# EasyEDA Pro project 3轴6.1--esp32 -(8-15) - 导BOM.eprj, board PCB
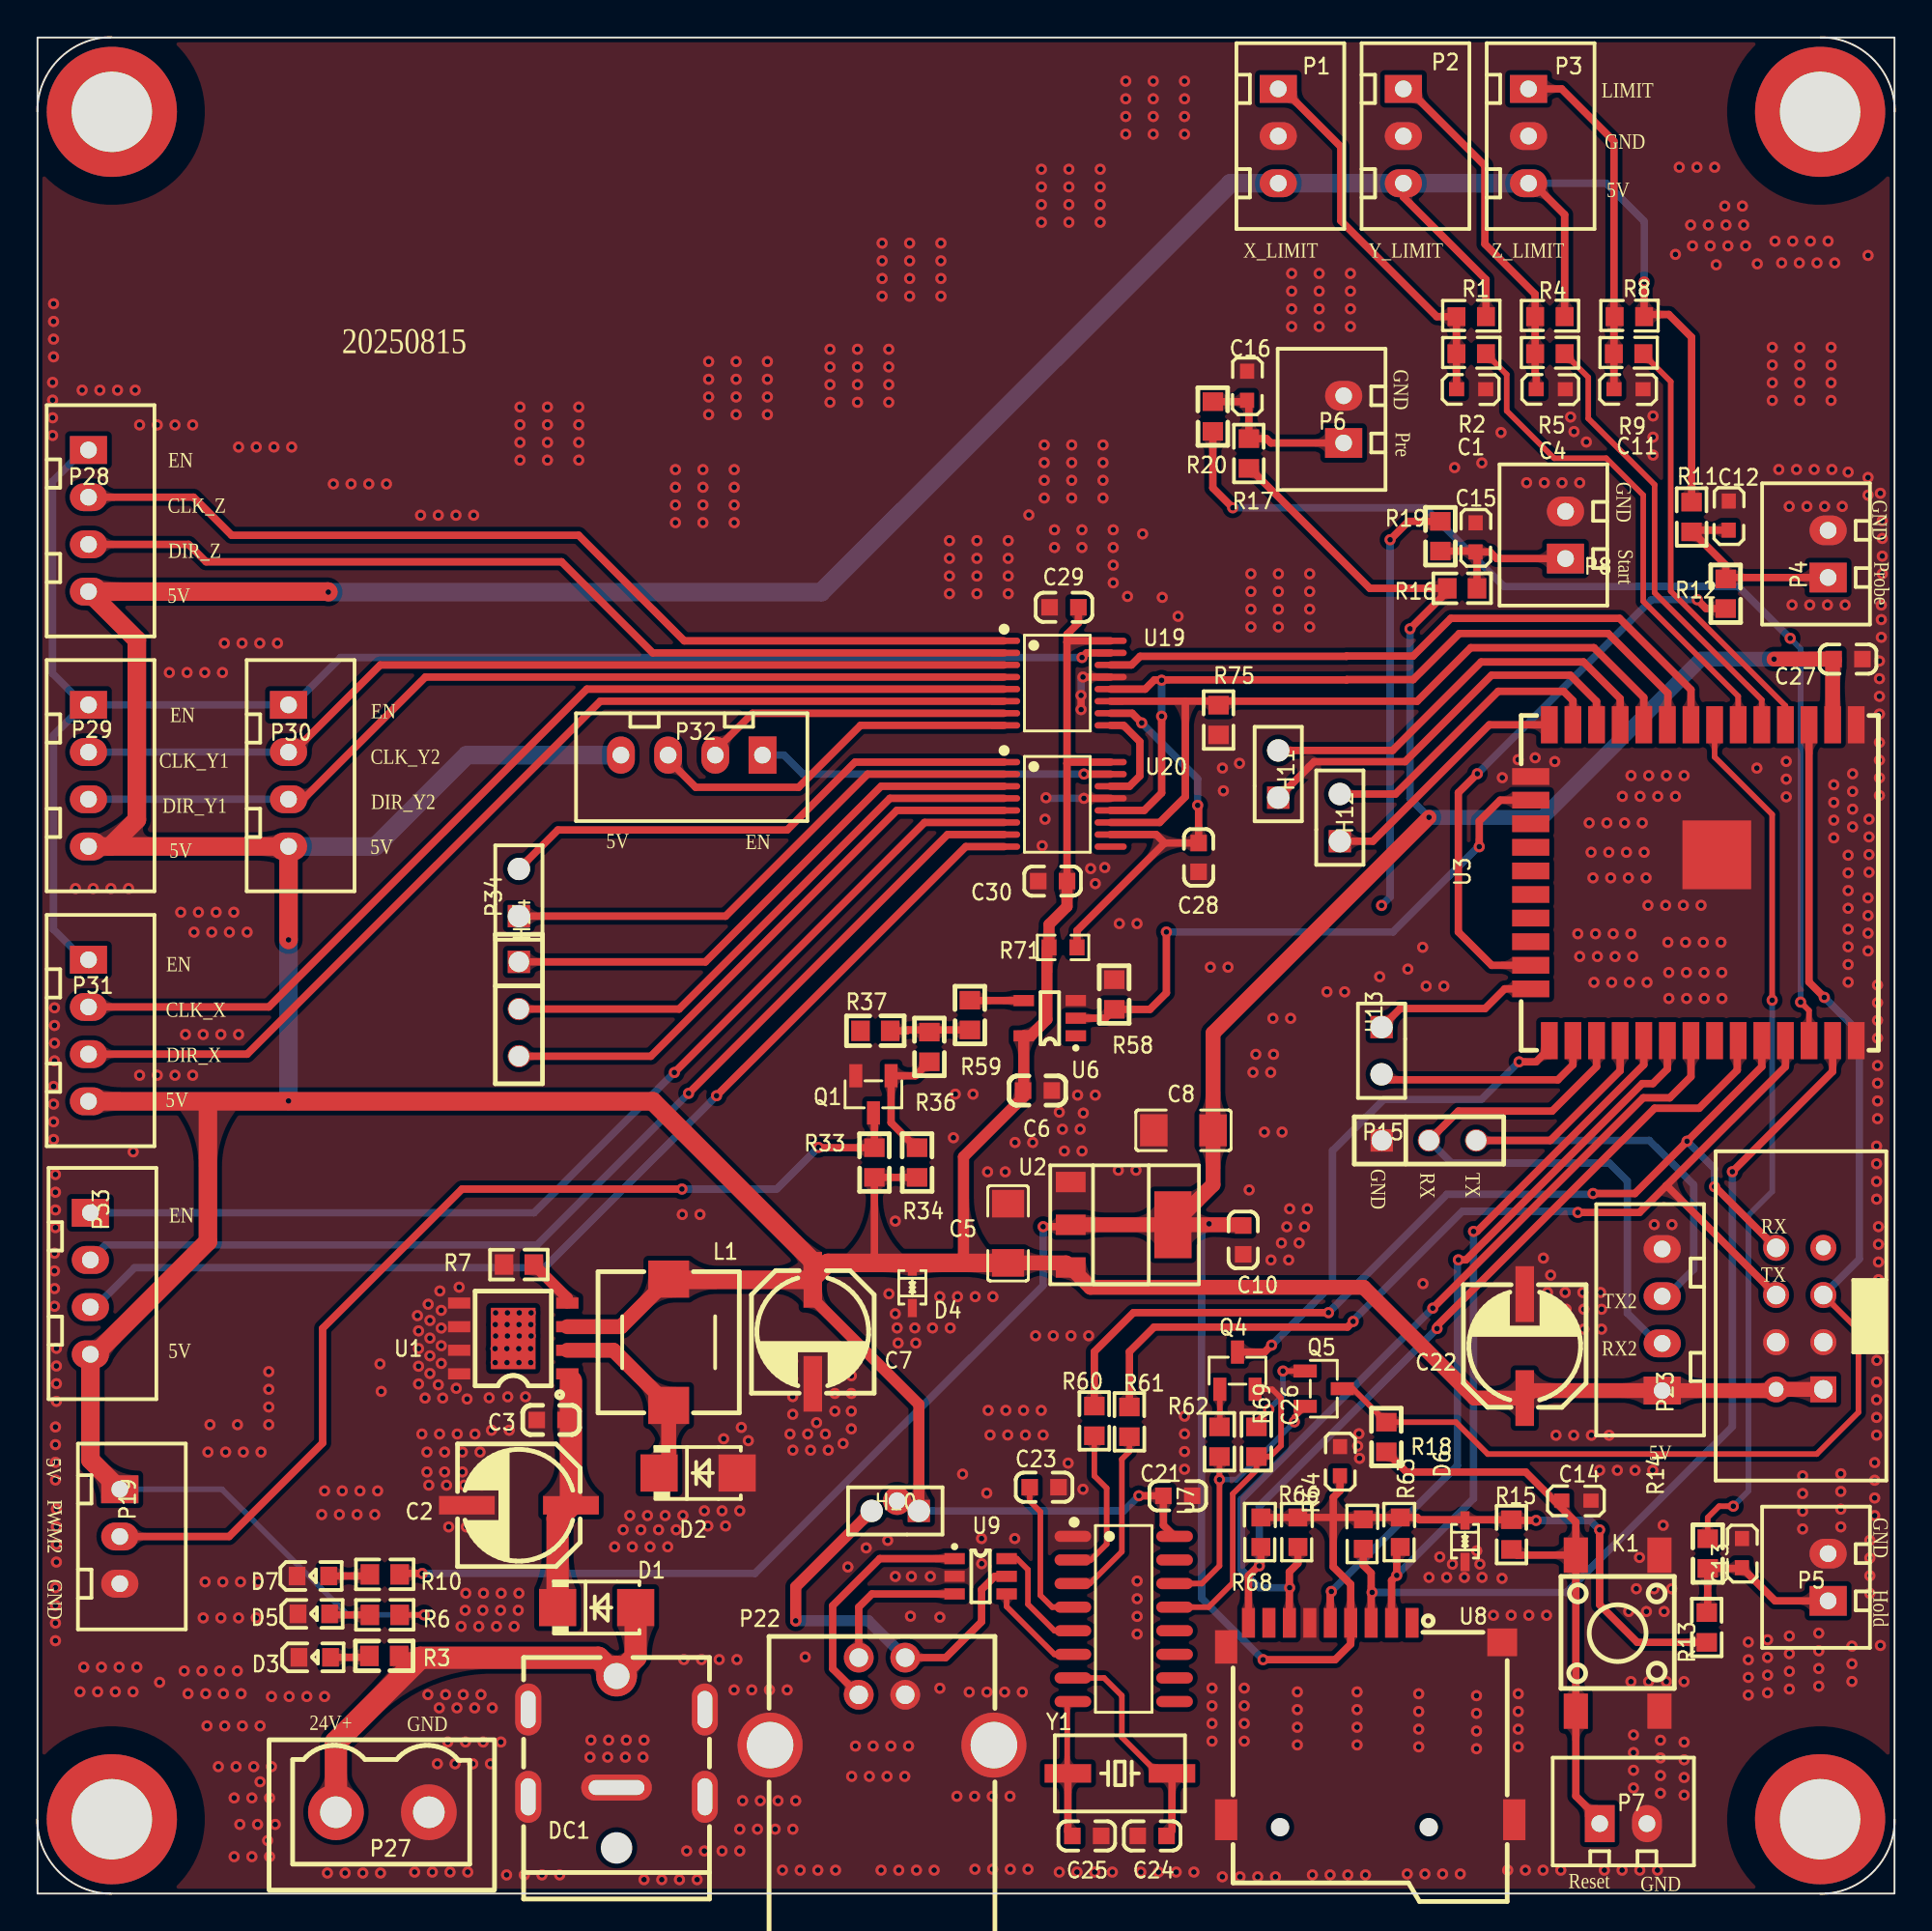
[diagram p1: board, top side]
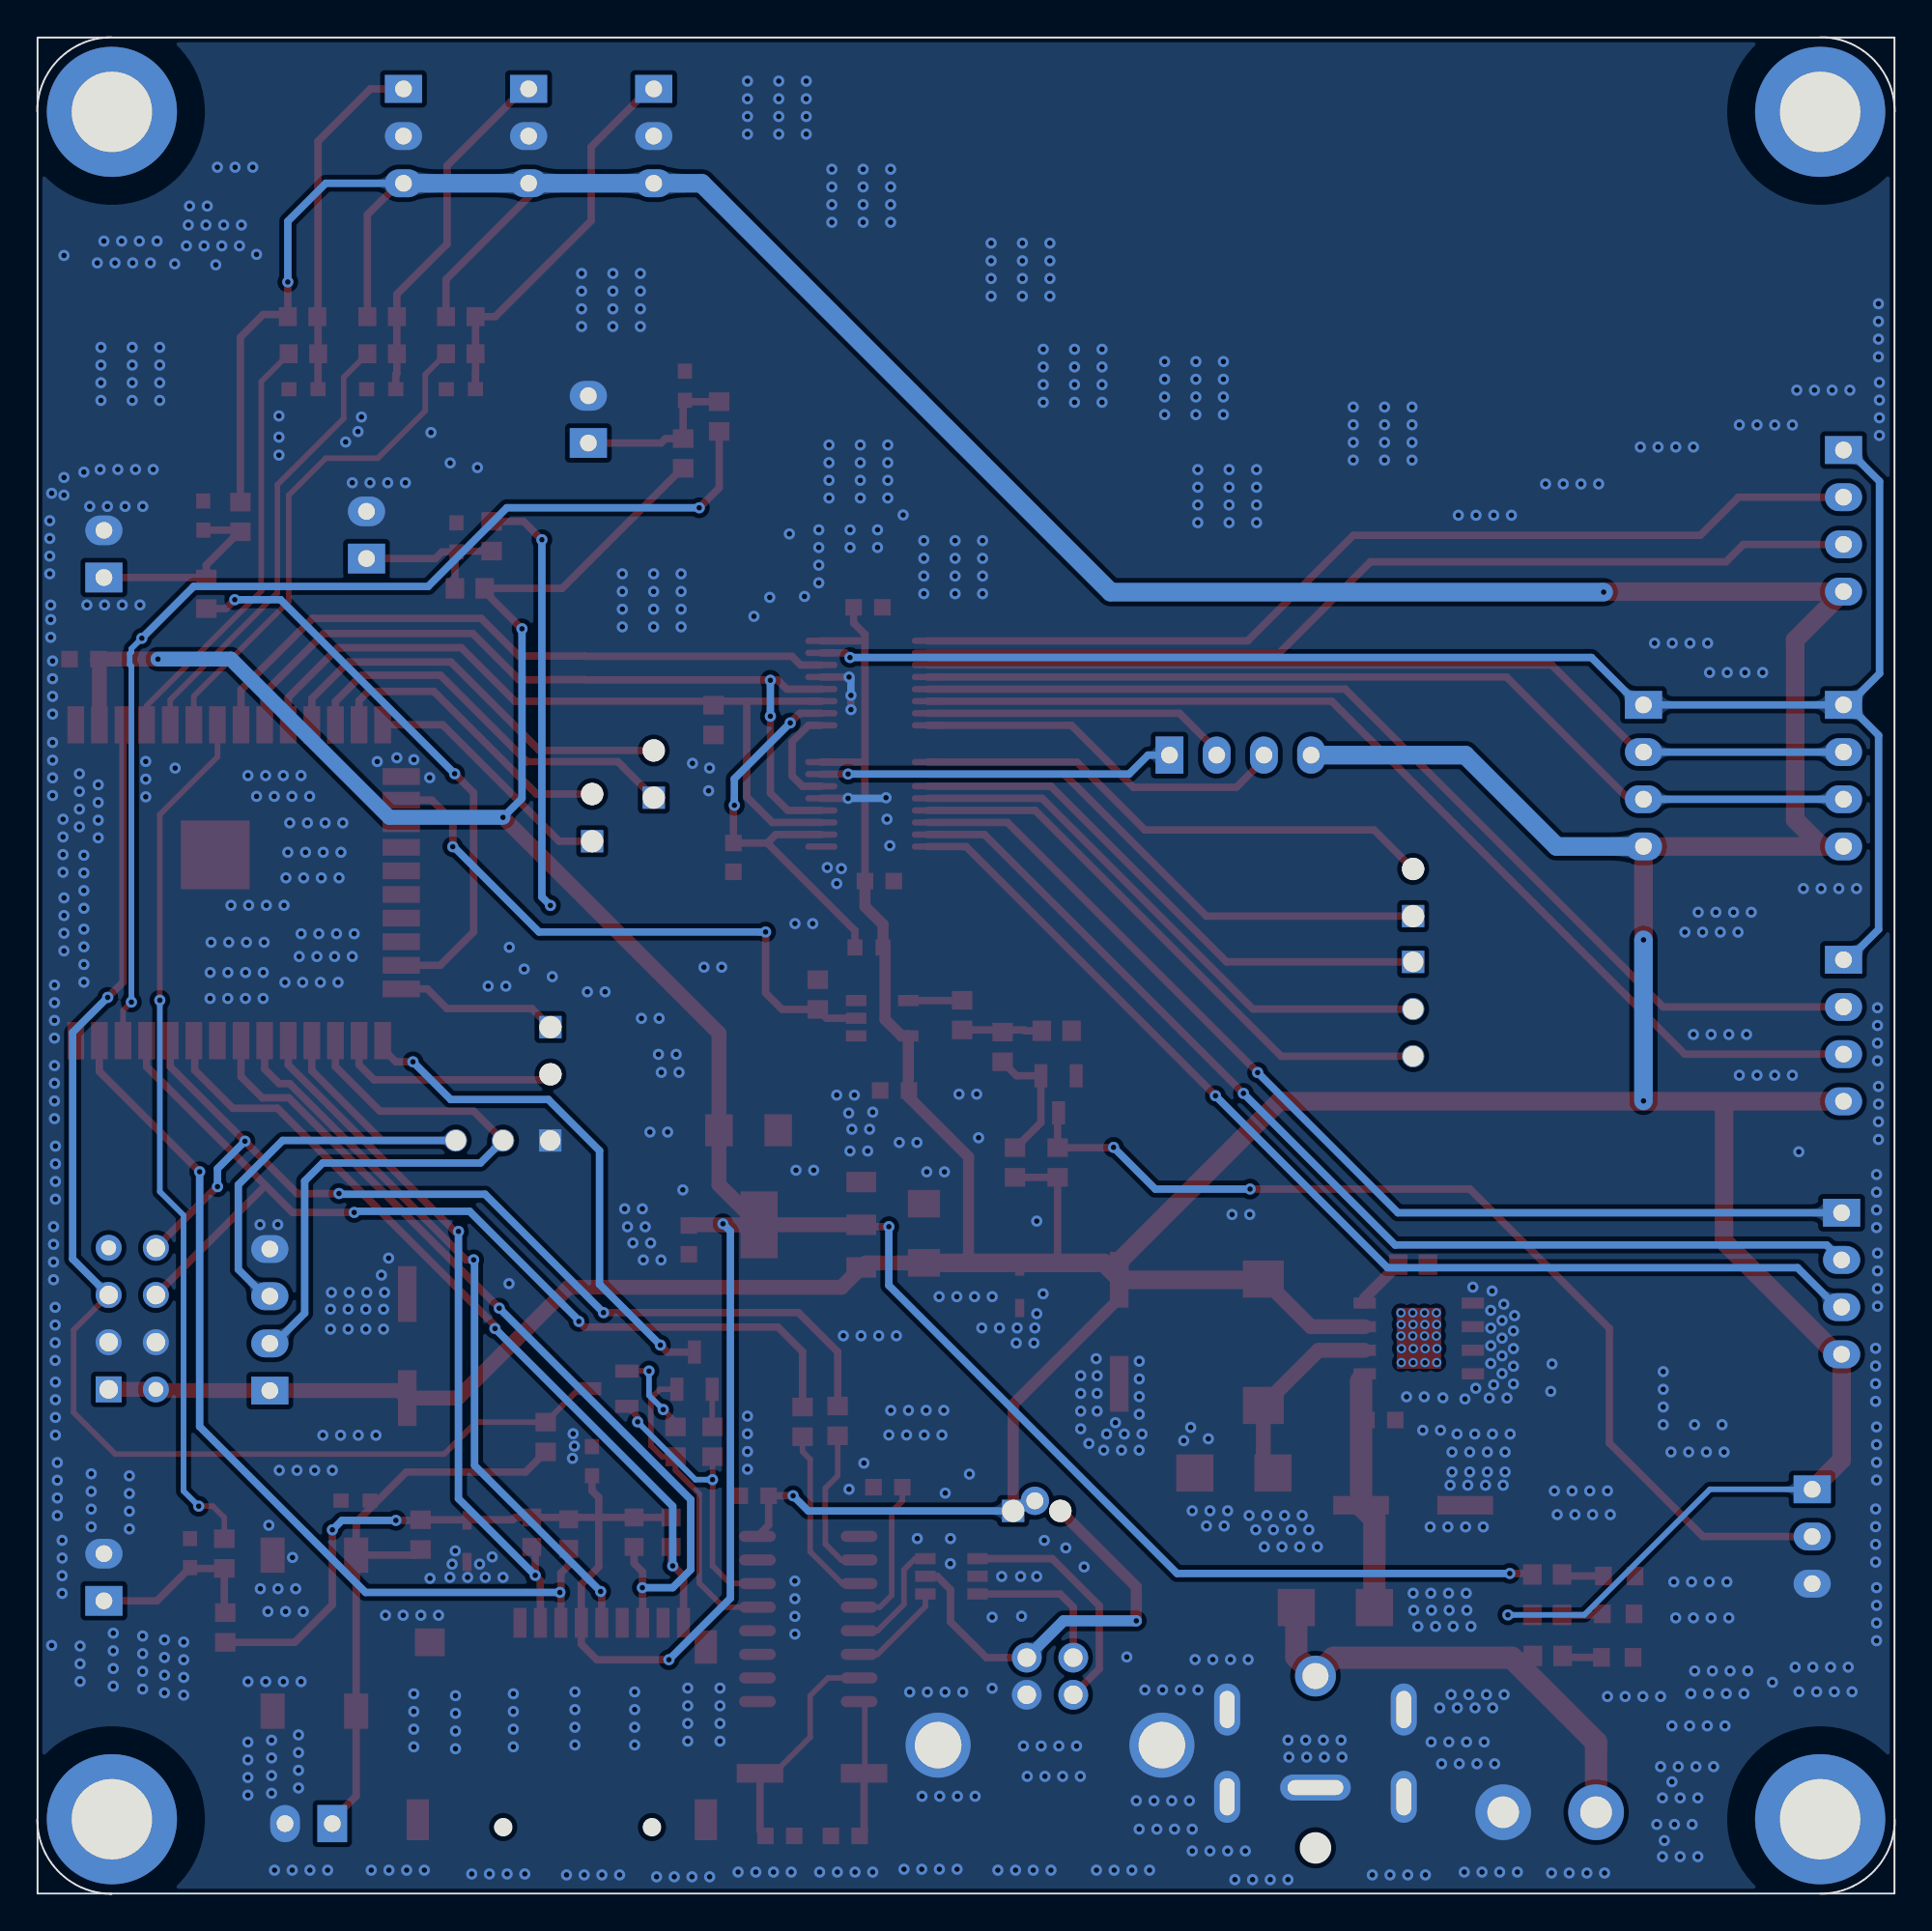
[diagram p2: board, bottom side, seen from below]

Outline 99.94 x 99.94 mm; copper layers: Top Layer, Bottom Layer. Coordinates in mm from the lower left corner of the outline.
Outline path: rectangle 0.02,99.92 99.92,0.02 ; 0.01,95.94 arc(1.18,98.77) 4.01,99.94 ; 4,0.01 arc(1.17,1.18) 0,4.01 ; 95.94,99.93 arc(98.77,98.76) 99.94,95.93 ; 99.93,4 arc(98.76,1.17) 95.93,0
Stack: Top Layer 0.035mm / Dielectric1 1.51mm FR4 er 4.5 / Bottom Layer 0.035mm

## Design rules (mm)
template: 用户自定义配置
spacing Default (default): track to track 0.152, other pairs 0 to 0.152
track width Default (default): min 0.254, default 0.254, max 25.4
differential pair differentialPair (default): width min 0.127, default 0.254, max 2.54; gap min 0.152, default 0.152
via Default (default): diameter min 0.25, default 0.61, max 100.025; hole min 0.2, default 0.305, max 59.995

## Placement (name value [footprint] x y rotation side)
C1  103  [11]  77.88 80.69 0 top
C2  100uF/35V  [电解电容贴片6X6]  25.91 20.92 180 top
C3  104  [0603C]  27.65 25.51 0 top
C4  103  [11]  82.17 80.69 0 top
C5  10uF  [C1206]  52.23 35.55 90 top
C6  104  [0603C]  53.81 43.24 180 top
C7  100uF/35V  [电解电容贴片6X6]  41.72 30.25 270 top
C8  4.7uF  [C1206]  61.67 41.1 0 top
C10  104  [0603C]  64.88 35.2 90 top
C11  103  [11]  86.35 80.69 0 top
C12  103  [11]  91.3 74.93 90 top
C13  103  [11]  92.01 19.08 90 top
C14  103  [11]  83.55 20.87 0 top
C15  103  [11]  77.68 73.75 90 top
C16  103  [11]  65.39 81.91 90 top
C21  104  [0603C]  61.36 21.43 0 top
C22  100uF/35V  [电解电容贴片6X6]  80.03 29.48 90 top
C23  104  [0603C]  54.17 21.89 0 top
C24  18pF  [0603C]  59.98 3.12 180 top
C25  18pF  [0603C]  56.46 3.12 0 top
C26  104  [11]  70.39 24.03 90 top
C27  104  [0603C]  97.42 66.46 0 top
C28  104  [0603C]  62.48 55.79 90 top
C29  104  [0603C]  55.24 69.25 180 top
C30  104  [0603C]  54.63 54.51 180 top
D1  SS56  [SMA]  30.1 15.41 0 top
D2  SS34  [SMA]  35.55 22.65 0 top
D3  绿光  [0603LED]  14.9 12.71 180 top
D4  PESD5V0L1BA-N  [SOD-323_L1.8-W1.3-LS2.5-BI]  47.08 32.65 90 top
D5  绿光  [0603LED]  14.85 15.05 180 top
D6  PESD3V3L1BA-N  [SOD-323_L1.8-W1.3-LS2.5-BI]  76.81 18.98 90 top
D7  绿光  [0603LED]  14.8 17.09 180 top
DC1  DC007B-2.5  [DC-IN-TH_HX-DC007B-2.5]  31.17 8.47 90 top
H10  PZ254V-11-02P  [HDR-TH_2P-P2.54-V-M]  46.16 20.61 180 top
H11  PZ254V-11-02P  [HDR-TH_2P-P2.54-V-M]  66.77 60.27 90 top
H12  PZ254V-11-02P  [HDR-TH_2P-P2.54-V-M]  70.08 57.93 90 top
H13  PZ254V-11-02P  [HDR-TH_2P-P2.54-V-M]  72.32 45.38 270 top
H14  PZ254V-11-02P  [HDR-TH_2P-P2.54-V-M]  25.91 53.89 90 top
K1  SW_6X6_H=12.0MM  [KEY-SMD_4P-L6.0-W6.0-P4.50-LS9.0]  85.03 14.03 270 top
L1  68uH  [IND-SMD_L7.0-W7.0_SMDRI74-330MT]  33.97 29.69 270 top
NOREF  -  [Pad_ie52]  95.92 4.02 90 top
NOREF#2  -  [Pad_ie51]  4.02 4.02 90 top
NOREF#3  -  [Pad_e1409]  46.26 21.16 0 top
NOREF#4  -  [Pad_ie53]  95.92 95.92 90 top
NOREF#5  -  [Pad_ie50]  4.02 95.92 90 top
P1  3P  [HDR1X3_CON]  66.77 94.61 270 top
P2  3P  [HDR1X3_CON]  73.5 94.61 270 top
P3  3P  [HDR1X3_CON]  80.23 94.61 270 top
P4  2P  [HDR1X2_CON]  96.35 72.12 90 top
P5  2P  [HDR1X2_CON]  96.35 17.04 90 top
P6  2P  [HDR1X2_CON]  70.29 79.36 90 top
P7  2P  [HDR1X2_CON]  85.33 3.78 0 top
P8  2P  [HDR1X2_CON]  82.22 73.14 90 top
P15  PZ254V-11-03P  [HDR-TH_3P-P2.54-V-M]  74.88 40.55 0 top
P19  3P  [HDR1X3_CON]  4.44 19.23 270 top
P21  8P  [IDC8]  95.07 30.96 90 top
P22  USB-B10-BRW  [USB-B-TH_USB-B10-BRW]  45.45 10.36 0 top
P23  4P  [HDR1X4_CON]  87.42 27.09 90 top
P27  5.08-2P  [CONN-TH_WJ2EDGVC-5.08-2P]  18.57 4.39 180 top
P28  4P  [HDR1X4_CON]  2.76 77.72 270 top
P29  4P  [HDR1X4_CON]  2.76 64 270 top
P30  4P  [HDR1X4_CON]  13.52 64 270 top
P31  4P  [HDR1X4_CON]  2.76 50.28 270 top
P32  4P  [HDR1X4_CON]  39.02 61.29 180 top
P33  4P  [HDR1X4_CON]  2.86 36.66 270 top
P34  PZ254V-11-03P  [HDR-TH_3P-P2.54-V-M]  25.91 47.62 270 top
Q1  SS8050  [SOT-23-3_L2.9-W1.3-P1.90-LS2.4-BR]  44.99 43.03 90 top
Q4  SS8050  [SOT-23-3_L2.9-W1.3-P1.90-LS2.4-BR]  64.57 28.16 270 top
Q5  SS8050  [SOT-23-3_L2.9-W1.3-P1.90-LS2.4-BR]  69.21 27.19 180 top
R1  20K  [10]  76.25 84.78 0 top
R2  100  [10]  76.25 82.78 0 top
R3  47K  [0603R]  18.67 12.81 0 top
R4  20K  [10]  80.49 84.78 0 top
R5  100  [10]  80.49 82.78 0 top
R6  10K  [0603R]  18.7 15.01 0 top
R7  10K  [0603R]  25.91 33.87 180 top
R8  20K  [10]  84.76 84.78 0 top
R9  100  [10]  84.72 82.78 0 top
R10  10K  [0603R]  18.7 17.19 0 top
R11  10K  [0603R]  89 74.11 270 top
R12  100  [0603R]  90.84 69.98 90 top
R13  10K  [0603R]  89.82 14.34 90 top
R14  100  [0603R]  89.87 18.32 270 top
R15  10K  [0603R]  79.31 19.34 270 top
R16  10K  [0603R]  76.66 70.27 0 top
R17  10K  [0603R]  65.19 77.53 90 top
R18  100  [0603R]  72.58 24.59 270 top
R19  100  [0603R]  75.49 73.07 270 top
R20  100  [0603R]  63.25 79.52 90 top
R33  10K  [0603R]  45.04 39.36 270 top
R34  10K  [0603R]  47.33 39.36 270 top
R36  1K  [0603R]  48 45.58 270 top
R37  0Ω  [0603R]  45.09 46.45 0 top
R58  10K  [0603R]  57.94 48.41 90 top
R59  100  [0603R]  50.18 47.3 270 top
R60  510Ω  [0603R]  56.87 25.46 90 top
R61  510Ω  [0603R]  58.76 25.41 90 top
R62  10K  [0603R]  63.6 24.33 90 top
R63  10K  [10]  73.45 18.57 90 top
R64  10K  [10]  71.46 18.47 90 top
R66  10K  [10]  67.94 18.57 90 top
R68  10K  [10]  65.95 18.57 90 top
R69  10K  [0603R]  65.59 24.33 90 top
R71  10kΩ  [R0603]  55.19 50.94 180 top
R75  10K  [0603R]  63.55 63.18 270 top
U1  XL1509-5.0E1//SXL1509-5.0E1  [ESOP-8_L4.9-W3.9-P1.27-LS6.0-BL-EP]  25.61 29.89 90 top
U2  1117-3.3  [SOT-223]  58.3 36.01 270 top
U3  ESP32-WROOM-32  [WIFI-SMD_ESP32-WROOM-32UE-A]  89.1 54.42 270 top
U6  74LVC1G17  [SOT-23-5]  54.48 47.13 180 top
U7  CH340G  [SOIC-16_L9.9-W3.9-P1.27-LS6.0-BL]  58.45 14.8 270 top
U8  自弹TF卡座TFAA  [SIM-SMD_C9900015645]  71.71 9.29 0 top
U9  USBLC2-2SC6  [SOT-23-6]  50.75 17.09 0 top
U19  74AHCT595T16-13  [TSSOP-16_L5.0-W4.4-P0.65-LS6.4-BL]  54.88 65.17 270 top
U20  74AHCT595T16-13  [TSSOP-16_L5.0-W4.4-P0.65-LS6.4-BL]  54.88 58.64 270 top
Y1  12M  [晶振贴片49SSMD]  58.25 6.48 0 top

## Footprints (pads in the part's own frame, mm; a bottom-side part is the same pattern mirrored in y, then rotated)
10
  rect 0.965x1.016 smd: 1(0.101,0.117) 2(1.688,0.117)
11
  rect 0.813x0.762 smd: 1(0.043,0.296) 2(-1.524,0.301)
0603C
  rect 0.889x0.889 smd: 1(-0.774,0) 2(0.774,0)
0603LED
  rect 0.9x1 smd: 1(-0.884,-0.017) 2(0.816,-0.017)
0603R
  rect 1x1.1 smd: 1(-0.8,0) 2(0.8,0)
C1206
  rect 1.485x1.728 smd: 1(-1.593,0) 2(1.593,0)
CONN-TH_WJ2EDGVC-5.08-2P
  round 3 hole 1.7: 1(-2.499,0) 2(2.499,0)
DC-IN-TH_HX-DC007B-2.5
  round 2.2 hole 1.4: 1(3.25,0)
  oval 1.4x3.8 hole 0.8x3: 2(-2.75,0)
  oval 2.8x1.4 hole 2x0.8: 3(-3.25,4.75) 3(-3.25,-4.75) 3(1.45,4.75) 3(1.45,-4.75)
ESOP-8_L4.9-W3.9-P1.27-LS6.0-BL-EP
  rect 0.6x1.2 smd: 1(-1.905,-2.909) 2(-0.635,-2.909) 3(0.635,-2.909) 4(1.905,-2.909) 5(1.905,2.909) 6(0.635,2.909) 7(-0.635,2.909) 8(-1.905,2.909)
  rect 3.3x2.4 smd: 9(0,0)
HDR1X2_CON
  rect 1.6x2 hole 0.9: 1(-1.27,0)
  oval 1.6x2 hole 0.9: 2(1.27,0)
HDR1X3_CON
  rect 1.5x2 hole 0.9: 1(-2.54,0)
  oval 1.5x2 hole 0.9: 2(0,0) 3(2.54,0)
HDR1X4_CON
  rect 1.5x2 hole 0.9: 1(0,0)
  oval 1.5x2 hole 0.9: 2(2.54,0) 3(5.08,0) 4(7.62,0)
HDR-TH_2P-P2.54-V-M
  rect 1.2x1.2 hole 1.2x0.8: 1(-1.27,0)
  round 1.2 hole 1.2x0.8: 2(1.27,0)
HDR-TH_3P-P2.54-V-M
  rect 1.2x1.2 hole 1.1x0.8: 1(-2.54,0)
  round 1.2 hole 1.1x0.8: 2(0,0) 3(2.54,0)
IDC8
  rect 1.4x1.4 hole 1: 1(-3.812,-1.019)
  round 1.4 hole 0.8: 2(-3.812,1.521) 7(3.808,-1.019)
  round 1.4 hole 1: 3(-1.272,-1.019) 4(-1.272,1.521) 5(1.268,-1.019) 6(1.268,1.521) 8(3.808,1.521)
IND-SMD_L7.0-W7.0_SMDRI74-330MT
  rect 2x2.2 smd: 1(-3.4,0) 2(3.4,0)
KEY-SMD_4P-L6.0-W6.0-P4.50-LS9.0
  rect 1.9x1.3 smd: 1(-4.2,2.25) 2(4.2,2.25) 3(-4.2,-2.25) 4(4.2,-2.25)
Pad_e1409
  round 1.524 hole 0.914: 1(0,0)
Pad_ie50
  round 7 hole 4.32: 0(0,0)
Pad_ie51
  round 7 hole 4.32: 0(0,0)
Pad_ie52
  round 7 hole 4.32: 0(0,0)
Pad_ie53
  round 7 hole 4.32: 0(0,0)
R0603
  rect 0.806x0.864 smd: 1(-0.753,0) 2(0.753,0)
SIM-SMD_C9900015645
  rect 0.7x1.6 smd: 1(2.25,5.3) 2(1.15,5.3) 3(0.05,5.3) 4(-1.05,5.3) 5(-2.15,5.3) 6(-3.25,5.3) 7(-4.35,5.3) 8(-5.45,5.3) 9(-6.55,5.3)
  rect 1.2x1.8 smd: 10(-7.75,4)
  rect 1.6x1.5 smd: 11(7.1,4.25)
  rect 1.2x2.2 smd: 12(-7.75,-5.3) 13(7.75,-5.3)
SMA
  rect 2x2 smd: 1(2.1,0) 2(-2.1,0)
SOD-323_L1.8-W1.3-LS2.5-BI
  rect 0.986x0.49 smd: 1(-1.117,0) 2(1.117,0)
SOIC-16_L9.9-W3.9-P1.27-LS6.0-BL
  oval 0.602x1.971 smd: 1(-4.445,-2.736) 2(-3.175,-2.736) 3(-1.905,-2.736) 4(-0.635,-2.736) 5(0.635,-2.736) 6(1.905,-2.736) 7(3.175,-2.736) 8(4.445,-2.736) 9(4.445,2.736) 10(3.175,2.736) 11(1.905,2.736) 12(0.635,2.736) 13(-0.635,2.736) 14(-1.905,2.736) 15(-3.175,2.736) 16(-4.445,2.736)
SOT-23-3_L2.9-W1.3-P1.90-LS2.4-BR
  rect 1.25x0.7 smd: 1(1,-0.95) 2(1,0.95) 3(-1,0)
SOT-23-5
  rect 1.1x0.6 smd: 1(-1.4,0.95) 2(-1.4,0) 3(-1.4,-0.95) 4(1.4,-0.95) 5(1.4,0.95)
SOT-23-6
  rect 1.1x0.6 smd: 1(-1.4,0.95) 2(-1.4,0) 3(-1.4,-0.95) 4(1.4,-0.95) 5(1.4,0) 6(1.4,0.95)
SOT-223
  rect 1.1x1.6 smd: 1(-2.3,-2.7) 2(0,-2.7) 3(2.3,-2.7)
  rect 3.6x2 smd: 4(0,2.8)
TSSOP-16_L5.0-W4.4-P0.65-LS6.4-BL
  oval 0.343x1.732 smd: 1(-2.275,-2.866) 2(-1.625,-2.866) 3(-0.975,-2.866) 4(-0.325,-2.866) 5(0.325,-2.866) 6(0.975,-2.866) 7(1.625,-2.866) 8(2.275,-2.866) 9(2.275,2.866) 10(1.625,2.866) 11(0.975,2.866) 12(0.325,2.866) 13(-0.325,2.866) 14(-0.975,2.866) 15(-1.625,2.866) 16(-2.275,2.866)
USB-B-TH_USB-B10-BRW
  round 1.6 hole 1: 1(1.25,2.355) 2(-1.25,2.355) 3(-1.25,0.355) 4(1.25,0.355)
  round 3.5 hole 2.5: 5(-6.02,-2.355) 6(6.02,-2.355)
WIFI-SMD_ESP32-WROOM-32UE-A
  rect 2x0.9 smd: 1(-8.5,8.755) 2(-8.5,7.485) 3(-8.5,6.215) 4(-8.5,4.945) 5(-8.5,3.675) 6(-8.5,2.405) 7(-8.5,1.135) 8(-8.5,-0.135) 9(-8.5,-1.405) 10(-8.5,-2.675) 11(-8.5,-3.945) 12(-8.5,-5.215) 13(-8.5,-6.485) 14(-8.5,-7.755) 25(8.5,-7.755) 26(8.5,-6.485) 27(8.5,-5.215) 28(8.5,-3.945) 29(8.5,-2.675) 30(8.5,-1.405) 31(8.5,-0.135) 32(8.5,1.135) 33(8.5,2.405) 34(8.5,3.675) 35(8.5,4.945) 36(8.5,6.215) 37(8.5,7.485) 38(8.5,8.755)
  rect 0.9x2 smd: 15(-5.715,-8.755) 16(-4.445,-8.755) 17(-3.175,-8.755) 18(-1.905,-8.755) 19(-0.635,-8.755) 20(0.635,-8.755) 21(1.905,-8.755) 22(3.175,-8.755) 23(4.445,-8.755) 24(5.715,-8.755)
  rect 3.7x3.7 smd: 39(-1.5,1.255)
晶振贴片49SSMD
  rect 2.5x1 smd: 1(-2.8,0) 2(2.8,0)
电解电容贴片6X6
  rect 3x1 smd: 1(-2.8,0) 2(2.8,0)

## Nets
3V3: C8.2 C10.2 C26.2 C27.1 D6.2 R10.2 R13.1 R15.1 R16.1 R17.1 R63.2 R64.2 R66.2 R68.2 U2.2 U2.4 U3.2 U8.4
5V_VCC: C5.1 C6.2 C7.1 C21.1 C22.1 C29.1 C30.1 D4.2 H10.1 L1.1 NOREF#3.1 P1.3 P2.3 P3.3 P19.1 P21.1 P21.2 P23.1 P28.4 P29.4 P30.4 P31.4 P32.4 P33.4 R1.2 R4.2 R6.2 R8.2 R11.1 R33.2 R34.2 R71.2 U1.3 U2.3 U6.5 U7.16 U19.16 U20.16
24V: D1.1 DC1.1 P27.2 R3.2
GND: C1.1 C2.2 C3.1 C4.1 C5.2 C6.1 C7.2 C8.1 C10.1 C11.1 C12.1 C13.1 C14.1 C15.1 C16.1 C21.2 C22.2 C23.2 C24.2 C25.2 C26.1 C27.2 C28.1 C29.2 C30.2 D2.1 D3.2 D4.1 D5.2 D6.1 D7.2 DC1.2 DC1.3 K1.1 K1.2 P1.2 P2.2 P3.2 P4.2 P5.2 P6.2 P7.2 P8.2 P15.1 P19.3 P21.3 P21.4 P22.4 P22.5 P22.6 P23.4 P27.1 Q1.2 R7.2 R58.2 R75.2 U1.5 U1.6 U1.7 U1.8 U2.1 U3.1 U3.15 U3.38 U3.39 U6.3 U7.1 U8.6 U8.10 U8.11 U8.12 U8.13 U9.2 U19.13 U20.13
VIN_24V: C2.1 C3.2 D1.2 U1.1
A_DIR_O: P32.3 U19.8
A_EN_O: P32.1 U20.15
A_STEP_O: P32.2 U19.7
B_DIR_O: P33.3 U20.8
B_EN_O: P33.1 U20.6
B_STEP_O: P33.2 U20.7
C_DIR_O: H14.1 U20.2
C_EN_O: P34.3 U20.5
C_STEP_O: H14.2 U20.1
D_DIR_O: P34.2 U20.4
D_STEP_O: P34.1 U20.3
ESP_BOOT: Q4.3 U3.25
ESP_RST: P21.5 Q5.3 R18.1 U3.3
HOLD: R14.1 U3.7
I2S_BCK: R75.1 U3.10 U19.11 U20.11
I2S_DATA: U3.8 U19.14
I2S_MR#: C28.2 R71.1 U19.10 U20.10
I2S_WS: U3.9 U19.12 U20.12
IO4: H13.2 U3.26
IO12: H12.1 U3.14
IO14: H12.2 U3.13
IO26: H11.2 U3.11
IO27: H11.1 U3.12
M_EN_O: P28.1 P29.1 P30.1 P31.1 U19.15
PRE: R20.1 U3.36
PROBE: R12.1 U3.23
PWM: R58.1 U3.16 U6.2
PWM_5V: P19.2 Q1.3 R33.1
PWM_OUT: R36.1 R37.2 R59.2
PWM_OUT2: R37.1
RUN: H13.1 U3.24
RXD: P21.8 R60.2 U3.34
RXD2: P15.2 P23.2 U3.27
SD_CD: R68.1 U3.33 U8.9
SD_CS: R63.1 U3.29 U8.2
SD_MISO: R66.1 U3.31 U8.7
SD_MOSI: R64.1 U3.37 U8.3
SD_SCLK: U3.30 U8.5
START: R19.1
TXD: P21.6 R61.2 U3.35
TXD2: P15.3 P23.3 U3.28
USB_DM: P22.2 U9.3
USB_DP: P22.3 U9.1
VUSB: H10.2 P22.1 U9.5
X_DIR_O: P28.3 U19.2
X_LIMT: R2.2 U3.6
X_LIMT_I: C1.2 P1.1 R1.1 R2.1
X_STEP_O: P28.2 U19.1
Y_DIR_O: P29.3 P30.3 U19.4
Y_LIMT: R5.2 U3.5
Y_LIMT_I: C4.2 P2.1 R4.1 R5.1
Y_STEP_O: P29.2 P30.2 U19.3
Z_DIR_O: P31.3 U19.6
Z_LIMT: R9.2 U3.4
Z_LIMT_I: C11.2 P3.1 R8.1 R9.1
Z_STEP_O: P31.2 U19.5
$9N72390: D2.2 L1.2 U1.2
$9N72392: R7.1 U1.4
$9N72730: D3.1 R3.1
$9N85928: C23.1 U7.4
$9N85949: U7.5 U9.6
$9N85958: U7.6 U9.4
$9N85962: C24.1 U7.7 Y1.2
$9N85965: C25.1 U7.8 Y1.1
$9N86544: R60.1 U7.2
$9N86546: R61.1 U7.3
$9N86982: Q4.2 R69.1 U7.13
$9N86987: Q5.2 R62.1 U7.14
$9N88961: R59.1 U6.4
$9N89334: Q4.1 R62.2
$9N89338: Q5.1 R69.2
$9N98710: C14.2 K1.3 K1.4 P7.1 R15.2 R18.2
$9N100309: C15.2 P8.1 R16.2 R19.2
$9N100484: C12.2 P4.1 R11.2 R12.2
$9N100628: C16.2 P6.1 R17.2 R20.2
$9N100772: C13.2 P5.1 R13.2 R14.2
$9N100840: D7.1 R10.1
$9N100955: D5.1 R6.1
$9N127007: U19.9 U20.14
$9N127825: Q1.1 R34.1 R36.2

Pads without a net: NOREF 0; NOREF#2 0; NOREF#4 0; NOREF#5 0; P21 7; U1 9; U3 17 18 19 20 21 22 32; U6 1; U7 9 10 11 12 15; U8 1 8; U20 9

## Via types
v1: diameter 0.5, hole 0.3, Top Layer to Bottom Layer, 20 vias
v2: diameter 0.6, hole 0.3, Top Layer to Bottom Layer, 1001 vias

## Routing (per net, layer and track width the routed paths; a pad name or vN(x,y) marks a point on that pad's centre or on a via; arc(x,y) is an arc through that point)
3V3: length 207.2
  Top Layer w0.4: v2(54.12,35.91) 55.5,35.91 U2.2 ; R68.2 R66.2 69.72,20.26 ; v2(65.95,12.6) 69.83,12.6 70.66,13.44 U8.4 70.66,16.66 69.72,17.6 69.72,20.26 ; v2(84.06,19.59) 84.06,15.56 86.08,13.54 R13.1 ; v2(80.64,20.1) 79.35,20.1 79.31,20.14 74.36,20.14 74.24,20.26 R63.2 69.72,20.26 ; R10.2 19.55,17.24 v2(20.71,17.24) ; 69.72,20.26 69.72,21.34 70.09,21.7 C26.2 ; v2(73.86,68.09) 75.86,70.1 R16.1 71.69,70.27 65.24,76.73 R17.1
  Top Layer w0.8: U2.4 63.26,38.17 C8.2 63.26,46.33 v2(74.88,57.94) ; U2.4 U2.2 ; U2.4 64.84,36.01 ; U3.2 96.59,66.3 96.69,66.41 ; v2(93.44,66.46) C27.1
  Bottom Layer w0.4: v2(54.12,35.91) 54.12,32.75 38.61,17.24 v2(20.71,17.24) ; v2(84.06,19.59) 83.55,20.1 v2(80.64,20.1) ; v2(73.86,68.09) 73.86,58.96 v2(74.88,57.94) ; v2(63.04,36.06) 62.64,35.66 62.64,15.91 v2(65.95,12.6)
  Bottom Layer w0.8: v2(93.44,66.46) 89.51,66.46 81,57.94 v2(74.88,57.94)
5V_VCC: length 428.4
  Top Layer w0.3: R6.2 v2(20.81,15.01)
  Top Layer w0.4: 55.4,60.85 55.4,67.38 ; 55.4,60.85 55.4,54.51 ; 55.4,60.85 55.47,60.92 57.75,60.92 ; 55.4,67.38 55.47,67.44 57.75,67.44 ; 55.4,67.38 55.4,67.79 56.01,68.4 C29.1 ; R11.1 89,83.78 87.78,85.01 86.57,85.01 R8.2 86.45,86.76 ; R34.2 R33.2 45.04,33.96 ; U7.16 60.59,19.84 C21.1 v2(59.27,21.43) ; R1.2 77.94,86.89 73.5,91.33 P2.3 ; R4.2 82.17,90.38 80.48,92.07 P3.3
  Top Layer w0.6: C7.1 41.72,32.05 47.43,26.34 H10.1 ; 49.62,33.96 49.83,34.18 49.83,39.67 53.08,42.91 U6.5 53.44,46.18 54.32,47.06 54.32,50.83 R71.2 54.44,52.18 55.4,53.14 55.4,54.51
  Top Layer w0.8: C5.1 55.35,33.96 U2.3 56.67,32.65 71.36,32.65 77.32,26.69 C22.1 80.43,27.09 P23.1 93.49,27.09 P21.2 P21.1 ; L1.1 31.41,30.53 U1.3
  Top Layer w1: 41.72,33.15 41.72,34.05 33.12,42.66 P31.4 ; 41.72,33.15 42.54,33.96 C5.1 ; 41.72,33.15 C7.1 34.01,33.05 L1.1 ; 9.19,42.32 9.19,35.11 3.11,29.04 P33.4 2.86,23.36 P19.1 ; 3.92,56.38 5.36,57.82 5.36,67.49 P28.4 15.63,70.1 v2(15.66,70.07) ; 3.92,56.38 P30.4 v2(13.52,51.35) ; 3.92,56.38 P29.4
  Bottom Layer w0.3: v2(20.81,15.01) 16.7,15.01 9.95,21.77 P19.1
  Bottom Layer w0.4: v2(59.27,21.43) 58.45,20.61 H10.1 ; v2(86.45,86.76) 86.45,90.03 84.41,92.07 P3.3
  Bottom Layer w1: P30.4 18.19,56.38 23.11,61.29 P32.4 ; P3.3 P2.3 P1.3 64.19,92.07 42.18,70.07 v2(15.66,70.07) ; v2(13.52,51.35) v2(13.52,42.68)
24V: length 26.5
  Top Layer w0.4: R3.2 20.51,12.81 20.61,12.71
  Top Layer w1.2: P27.2 16.07,8.17 20.61,12.71 30.19,12.71 DC1.1 32.2,12.75 D1.1
GND: length 6.8
  Top Layer w0.4: v2(56.16,64.51) v2(56.16,63.74) ; 57.75,65.49 v2(56.26,65.49) ; 57.75,58.97 v2(56.31,58.97)
  Bottom Layer w0.4: v2(56.31,58.97) 54.3,58.97 v2(54.27,59) ; v2(56.16,64.51) 56.16,65.39 v2(56.26,65.49)
  vias: v2(0.83,81.35) v2(0.83,80.4) v2(0.83,79.45) v2(0.83,78.5) v2(0.88,85.59) v2(0.88,84.63) v2(0.88,83.68) v2(0.88,82.73) v2(0.93,47.69) v2(0.93,46.74) v2(0.93,45.79) v2(0.93,44.84) v2(0.88,43.46) v2(0.88,42.51) v2(0.88,41.56) v2(0.88,40.6) v2(0.93,34.48) v2(0.93,33.53) v2(0.93,32.58) v2(0.93,31.63) v2(0.98,38.72) v2(0.98,37.76) v2(0.98,36.81) v2(0.98,35.86) v2(1.03,29.36) v2(1.03,28.41) v2(1.03,27.46) v2(1.03,26.51) v2(0.98,25.13) v2(0.98,24.18) v2(0.98,23.23) v2(0.98,22.27) v2(1.03,20.71) v2(1.03,19.76) v2(1.03,18.81) v2(1.03,17.86) v2(0.98,16.48) v2(0.98,15.53) v2(0.98,14.58) v2(0.98,13.62) v2(2.06,54.11) v2(2.3,10.88) v2(2.42,80.94) v2(2.5,12.2) v2(3.01,54.11) v2(3.25,10.88) v2(3.37,80.94) v2(3.46,12.2) v2(3.97,54.11) v2(4.2,10.88) v2(4.32,80.94) v2(4.41,12.2) v2(4.92,54.11) v2(5.17,39.94) v2(5.16,10.88) v2(5.27,80.94) v2(5.36,12.2) v2(5.51,79.07) v2(5.51,44.06) v2(6.46,79.07) v2(6.46,44.06) v2(6.58,11.39) v2(7.11,65.74) v2(7.41,79.07) v2(7.41,44.06) v2(7.72,52.83) v2(7.91,12) v2(7.98,46.26) v2(8.06,65.74) v2(8.11,10.77) v2(8.37,79.07) v2(8.44,51.76) v2(8.37,44.06) v2(8.67,52.83) v2(8.93,46.26) v2(8.93,14.85) v2(8.86,12) v2(9.02,65.74) v2(9.03,16.79) v2(9.07,10.77) v2(9.14,9.04) v2(9.19,23.78) v2(9.3,25.25) v2(9.39,51.76) v2(9.63,52.83) v2(9.81,12) v2(9.75,6.85) v2(9.88,46.26) v2(9.88,14.85) v2(9.97,65.74) v2(9.98,16.79) v2(10.02,10.77) v2(10.07,67.32) v2(10.09,9.04) v2(10.14,23.78) v2(10.34,51.76) v2(10.58,52.83) v2(10.6,5.16) v2(10.6,2) v2(10.7,6.85) v2(10.83,77.88) v2(10.83,46.26) v2(10.78,25.25) v2(10.83,14.85) v2(10.77,12) v2(10.94,16.79) v2(10.9,3.74) v2(11.02,67.32) v2(10.97,10.77) v2(11.09,23.78) v2(11.04,9.04) v2(11.29,51.76) v2(11.55,5.16) v2(11.55,2) v2(11.65,6.85) v2(11.79,77.88) v2(11.79,14.85) v2(11.89,16.79) v2(11.86,3.74) v2(11.97,67.32) v2(11.99,9.04) v2(11.99,6.03) v2(12.04,23.78) v2(12.4,2.87) v2(12.46,28.11) v2(12.46,27.16) v2(12.46,26.2) v2(12.46,25.25) v2(12.5,5.16) v2(12.5,2) v2(12.6,10.62) v2(12.6,6.85) v2(12.74,77.88) v2(12.81,3.74) v2(12.92,67.32) v2(13.56,10.62) v2(13.69,77.88) v2(14.51,10.62) v2(15.31,20.41) v2(15.46,21.69) v2(15.46,10.62) v2(15.61,1.12) v2(15.93,75.89) v2(16.26,20.41) v2(16.41,21.69) v2(16.57,1.12) v2(16.89,75.89) v2(17.21,20.41) v2(17.36,21.69) v2(17.52,1.12) v2(17.84,75.89) v2(18.16,20.41) v2(18.31,21.69) v2(18.44,28.52) v2(18.51,27.04) v2(18.47,1.12) v2(18.79,75.89) v2(20.31,1.17) v2(20.46,31.12) v2(20.52,30.3) v2(20.52,29.35) v2(20.52,28.4) v2(20.52,27.45) v2(20.63,74.2) v2(20.69,24.75) v2(20.86,26.69) v2(21.03,31.74) v2(20.97,23.78) v2(20.97,22.71) v2(21.02,10.72) v2(21.13,30.86) v2(21.13,29.91) v2(21.13,28.96) v2(21.13,28.01) v2(21.07,21.99) v2(21.26,1.17) v2(21.53,7) v2(21.58,74.2) v2(21.58,27.4) v2(21.63,10.01) v2(21.66,32.45) v2(21.65,24.75) v2(21.74,31.41) v2(21.74,30.45) v2(21.74,29.5) v2(21.74,28.55) v2(21.82,26.69) v2(21.92,23.78) v2(21.92,22.71) v2(22.02,21.99) v2(21.97,10.72) v2(22.09,8.17) v2(22.14,19.75) v2(22.21,1.17) v2(22.53,74.2) v2(22.48,7) v2(22.55,27.21) v2(22.6,24.75) v2(22.58,10.01) v2(22.7,32.65) v2(22.8,14.4) v2(22.87,23.78) v2(22.87,22.71) v2(22.92,10.72) v2(22.97,21.99) v2(23.02,15.26) v2(23.13,26.64) v2(23.09,19.75) v2(23.06,16.18) v2(23.04,8.17) v2(23.16,1.17) v2(23.43,7) v2(23.48,74.2) v2(23.53,10.01) v2(23.55,24.75) v2(23.82,23.78) v2(23.82,22.71) v2(23.75,14.4) v2(23.92,21.99) v2(23.87,10.72) v2(24.01,16.18) v2(23.98,15.26) v2(23.99,8.17) v2(24.04,19.75) v2(24.31,26.7) v2(24.38,7) v2(24.44,24.95) v2(24.49,10.01) v2(24.71,14.4) v2(24.93,15.26) v2(25,19.75) v2(24.96,16.18) v2(24.94,8.17) v2(25.32,26.75) v2(25.25,1.02) v2(25.39,24.95) v2(25.66,14.4) v2(25.91,16.18) v2(25.88,15.26) v2(25.97,80.03) v2(25.97,79.08) v2(25.97,78.12) v2(25.97,77.17) v2(26.21,1.02) v2(26.27,26.75) v2(27.16,1.02) v2(27.45,80.03) v2(27.45,79.08) v2(27.45,78.12) v2(27.45,77.17) v2(28.11,1.02) v2(29.13,80.03) v2(29.13,79.08) v2(29.13,78.12) v2(29.13,77.17) v2(29.79,8.28) v2(29.74,7.36) v2(30.69,7.36) v2(30.74,8.28) v2(31.06,18.68) v2(31.52,19.6) v2(31.69,8.28) v2(31.64,7.36) v2(31.88,20.36) v2(32.02,18.68) v2(32.48,19.6) v2(32.59,7.36) v2(32.65,8.28) v2(32.65,0.76) v2(32.83,20.36) v2(32.97,18.68) v2(33.43,19.6) v2(33.6,0.76) v2(33.78,20.36) v2(33.92,18.68) v2(34.34,76.66) v2(34.34,75.71) v2(34.34,74.76) v2(34.34,73.81) v2(34.38,19.6) v2(34.55,0.76) v2(34.71,36.57) v2(34.74,20.36) v2(34.79,12.61) v2(34.94,2.31) v2(35.5,0.76) v2(35.66,36.57) v2(35.82,76.66) v2(35.82,75.71) v2(35.82,74.76) v2(35.82,73.81) v2(35.74,12.61) v2(35.89,20.62) v2(35.89,2.31) v2(36.12,82.48) v2(36.12,81.52) v2(36.12,80.57) v2(36.12,79.62) v2(36.08,19.8) v2(36.69,12.61) v2(36.93,24.49) v2(36.84,20.62) v2(36.84,2.31) v2(37.03,19.8) v2(37.5,76.66) v2(37.5,75.71) v2(37.5,74.76) v2(37.5,73.81) v2(37.49,10.98) v2(37.6,82.48) v2(37.6,81.52) v2(37.6,80.57) v2(37.6,79.62) v2(37.64,12.61) v2(37.8,20.62) v2(37.8,3.48) v2(37.8,2.31) v2(37.88,25.11) v2(37.95,5.01) v2(38.26,24.39) v2(38.44,10.98) v2(38.75,3.48) v2(38.9,5.01) v2(39.28,82.48) v2(39.28,81.52) v2(39.28,80.57) v2(39.28,79.62) v2(39.4,10.98) v2(39.7,3.48) v2(39.85,5.01) v2(40.09,1.27) v2(40.35,10.98) v2(40.5,24.75) v2(40.65,28.67) v2(40.65,27.72) v2(40.65,26.76) v2(40.65,25.81) v2(40.65,23.88) v2(40.65,3.48) v2(40.81,5.01) v2(41.05,1.27) v2(41.32,12.75) v2(41.45,24.75) v2(41.61,23.88) v2(41.93,25.36) v2(42,1.27) v2(42.4,24.75) v2(42.56,23.88) v2(42.65,83.14) v2(42.65,82.19) v2(42.65,81.23) v2(42.65,80.28) v2(42.91,27.89) v2(42.91,26.93) v2(42.91,25.98) v2(42.97,28.8) v2(42.95,1.27) v2(43.36,24.24) v2(43.61,17.59) v2(43.8,27.89) v2(43.8,26.93) v2(43.8,25.98) v2(43.8,25.03) v2(43.82,6.32) v2(44.02,7.96) v2(44.13,83.14) v2(44.13,82.19) v2(44.13,81.23) v2(44.13,80.28) v2(44.6,18.62) v2(44.77,6.32) v2(44.97,7.96) v2(45.4,1.27) v2(45.46,88.85) v2(45.46,87.9) v2(45.46,86.95) v2(45.46,85.99) v2(45.72,6.32) v2(45.81,83.14) v2(45.81,82.19) v2(45.81,81.23) v2(45.81,80.28) v2(45.82,32.3) v2(45.76,19.02) v2(45.93,7.96) v2(46.16,36.21) v2(46.16,31.23) v2(46.16,17.08) v2(46.26,30.46) v2(46.31,29.64) v2(46.35,1.27) v2(46.67,6.32) v2(46.93,88.85) v2(46.93,87.9) v2(46.93,86.95) v2(46.93,85.99) v2(46.88,7.96) v2(47.03,17.08) v2(46.98,14.94) v2(47.22,30.46) v2(47.27,29.64) v2(47.3,1.27) v2(48.05,17.08) v2(48.17,30.46) v2(48.25,1.27) v2(48.62,88.85) v2(48.62,87.9) v2(48.62,86.95) v2(48.62,85.99) v2(48.56,32.14) v2(48.56,14.89) v2(48.56,11.07) v2(49.08,72.84) v2(49.08,71.88) v2(49.08,70.93) v2(49.08,69.98) v2(49.12,30.46) v2(49.29,40.7) v2(49.39,43.04) v2(49.51,32.14) v2(49.48,5.25) v2(49.78,22.59) v2(50.14,10.86) v2(50.35,43.04) v2(50.43,5.25) v2(50.46,32.14) v2(50.45,1.33) v2(50.56,72.84) v2(50.56,71.88) v2(50.56,70.93) v2(50.56,69.98) v2(50.8,19.12) v2(50.81,17.77) v2(51.13,38.86) v2(51.09,21.57) v2(51.09,10.86) v2(51.16,26.02) v2(51.26,24.7) v2(51.41,32.14) v2(51.38,5.25) v2(51.4,1.33) v2(52.08,38.86) v2(52.11,26.02) v2(52.05,10.86) v2(52.21,24.7) v2(52.24,72.84) v2(52.24,71.88) v2(52.24,70.93) v2(52.24,69.98) v2(52.33,5.25) v2(52.35,1.33) v2(52.61,40.44) v2(52.59,19.12) v2(53,10.86) v2(53.06,26.02) v2(53.17,24.7) v2(53.3,1.33) v2(53.35,74.22) v2(53.56,40.44) v2(53.71,30.04) v2(54.02,92.83) v2(54.02,91.88) v2(54.02,90.92) v2(54.02,89.97) v2(54.02,26.02) v2(54.07,56.42) v2(54.12,24.7) v2(54.18,77.99) v2(54.18,77.04) v2(54.18,76.08) v2(54.18,75.13) v2(54.22,57.84) v2(54.73,73.42) v2(54.73,72.47) v2(54.66,30.04) v2(54.99,42.07) v2(54.99,1.17) v2(55.16,41.16) v2(55.26,39.98) v2(55.5,92.83) v2(55.5,91.88) v2(55.5,90.92) v2(55.5,89.97) v2(55.46,23.19) v2(55.62,30.04) v2(55.66,77.99) v2(55.66,77.04) v2(55.66,76.08) v2(55.66,75.13) v2(55.97,42.99) v2(55.94,1.17) v2(56.11,41.16) v2(56.21,73.42) v2(56.21,72.47) v2(56.21,39.98) v2(56.28,42.02) v2(56.26,21.78) v2(56.57,30.04) v2(56.67,55.18) v2(56.92,54.38) v2(56.92,42.99) v2(56.89,1.17) v2(57.19,92.83) v2(57.19,91.88) v2(57.19,90.92) v2(57.19,89.97) v2(57.34,77.99) v2(57.34,77.04) v2(57.34,76.08) v2(57.34,75.13) v2(57.43,55.24) v2(57.89,73.42) v2(57.89,72.47) v2(57.89,71.52) v2(57.89,70.56) v2(57.84,1.17) v2(58.22,52.22) v2(58.16,38.95) v2(58.56,97.57) v2(58.56,96.62) v2(58.56,95.67) v2(58.56,94.72) v2(58.66,69.83) v2(59.11,38.95) v2(59.17,52.22) v2(59.17,16.84) v2(59.17,15.89) v2(59.17,14.93) v2(59.17,13.98) v2(59.37,1.17) v2(59.47,73.2) v2(60.04,97.57) v2(60.04,96.62) v2(60.04,95.67) v2(60.04,94.72) v2(60.32,1.17) v2(60.53,69.78) v2(61.28,1.17) v2(61.38,68.76) v2(61.72,97.57) v2(61.72,96.62) v2(61.72,95.67) v2(61.72,94.72) v2(61.72,25.71) v2(61.72,24.76) v2(61.72,23.81) v2(61.72,22.86) v2(62.23,1.17) v2(63.11,49.88) v2(63.2,11.07) v2(63.2,10.12) v2(63.2,9.17) v2(63.2,8.22) v2(63.76,60.6) v2(63.82,59.37) v2(63.76,0.92) v2(64.06,49.88) v2(64.68,60.85) v2(64.71,0.92) v2(64.94,11.07) v2(64.94,10.12) v2(64.94,9.17) v2(64.94,8.22) v2(65.2,37.89) v2(65.29,71.05) v2(65.29,70.1) v2(65.29,69.15) v2(65.29,68.2) v2(65.41,44.22) v2(65.56,45.19) v2(65.66,0.92) v2(66.02,41) v2(66.36,44.22) v2(66.37,34.12) v2(66.48,47.12) v2(66.51,45.19) v2(66.61,0.92) v2(66.77,71.05) v2(66.77,70.1) v2(66.77,69.15) v2(66.77,68.2) v2(66.94,35.03) v2(66.97,41) v2(67.23,35.9) v2(67.33,34.12) v2(67.43,47.12) v2(67.38,36.87) v2(67.49,87.22) v2(67.49,86.27) v2(67.49,85.31) v2(67.49,84.36) v2(67.79,10.87) v2(67.79,9.92) v2(67.79,8.97) v2(67.79,8.01) v2(67.89,35.03) v2(68.18,35.9) v2(68.33,36.87) v2(68.46,71.05) v2(68.46,70.1) v2(68.46,69.15) v2(68.46,68.2) v2(68.6,1.02) v2(68.97,87.22) v2(68.97,86.27) v2(68.97,85.31) v2(68.97,84.36) v2(69.39,48.55) v2(69.56,1.02) v2(70.34,48.55) v2(70.51,1.02) v2(70.65,87.22) v2(70.65,86.27) v2(70.65,85.31) v2(70.65,84.36) v2(71.04,24.1) v2(71.01,10.87) v2(71.01,9.92) v2(71.01,8.97) v2(71.01,8.01) v2(71.1,24.77) v2(71.14,23.44) v2(71.46,1.02) v2(72.22,49.37) v2(73.7,1.07) v2(73.74,49.78) v2(74.32,10.77) v2(74.32,9.82) v2(74.32,8.86) v2(74.32,7.91) v2(74.54,50.95) v2(74.55,32.84) v2(74.72,48.86) v2(74.66,1.07) v2(74.88,17.03) v2(75.46,18.14) v2(75.61,1.07) v2(75.68,48.86) v2(75.83,17.03) v2(76.14,17.75) v2(76.25,76.77) v2(76.56,1.07) v2(76.78,17.03) v2(77.43,10.67) v2(77.43,9.71) v2(77.43,8.76) v2(77.43,7.81) v2(77.44,18.46) v2(77.61,17.75) v2(77.72,77.02) v2(77.73,17.03) v2(78.34,14.99) v2(78.75,78.66) v2(78.82,60.08) v2(78.8,16.98) v2(79.11,1.27) v2(79.3,14.99) v2(79.67,61.05) v2(79.68,10.77) v2(79.68,9.82) v2(79.68,8.86) v2(79.68,7.91) v2(80.13,75.95) v2(80.06,1.27) v2(80.25,14.99) v2(80.59,61.15) v2(81.03,34.22) v2(81.01,1.27) v2(81.08,75.95) v2(81.2,14.99) v2(81.25,32.37) v2(81.3,31.47) v2(81.3,30.4) v2(81.42,33.3) v2(81.64,60.95) v2(81.71,24.68) v2(82.03,75.95) v2(81.97,1.27) v2(82.2,32.37) v2(82.25,31.47) v2(82.25,30.4) v2(82.49,79.49) v2(82.68,78.71) v2(82.66,24.68) v2(82.88,51.68) v2(82.98,75.95) v2(82.98,50.45) v2(83.16,32.37) v2(83.21,31.47) v2(83.21,30.4) v2(83.34,78.15) v2(83.49,57.64) v2(83.6,56.06) v2(83.62,24.68) v2(83.7,54.69) v2(83.83,51.68) v2(83.75,49.06) v2(83.94,50.45) v2(84.11,32.37) v2(84.06,22.8) v2(84.16,31.47) v2(84.16,30.4) v2(84.31,1.27) v2(84.45,57.64) v2(84.55,56.06) v2(84.57,24.68) v2(84.65,54.69) v2(84.7,49.06) v2(84.79,51.68) v2(84.89,50.45) v2(85.01,22.8) v2(85.28,59.07) v2(85.26,1.27) v2(85.4,57.64) v2(85.5,56.06) v2(85.6,54.69) v2(85.62,15.2) v2(85.66,49.06) v2(85.74,60.19) v2(85.74,51.68) v2(85.74,11.42) v2(85.84,50.45) v2(85.88,8.56) v2(85.88,7.6) v2(85.88,6.65) v2(85.88,5.7) v2(85.96,22.8) v2(86.03,16.42) v2(86.23,59.07) v2(86.2,18.1) v2(86.22,1.27) v2(86.35,57.64) v2(86.45,56.06) v2(86.55,54.69) v2(86.61,49.06) v2(86.57,15.2) v2(86.7,60.19) v2(86.66,53.21) v2(86.69,11.42) v2(86.93,79.55) v2(86.93,78.41) v2(86.93,77.44) v2(86.91,22.8) v2(86.99,36.02) v2(86.98,16.42) v2(87.18,59.07) v2(87.17,1.27) v2(87.33,8.27) v2(87.33,7.32) v2(87.33,6.37) v2(87.33,5.41) v2(87.47,19.84) v2(87.53,15.2) v2(87.61,53.21) v2(87.65,60.19) v2(87.73,51.22) v2(87.64,11.42) v2(87.77,49.59) v2(87.78,48.19) v2(87.93,16.42) v2(87.95,36.02) v2(88.13,88.24) v2(88.13,59.07) v2(88.34,92.94) v2(88.6,60.19) v2(88.56,53.21) v2(88.6,11.42) v2(88.6,8.17) v2(88.6,7.22) v2(88.6,6.26) v2(88.6,5.31) v2(88.68,51.22) v2(88.72,49.59) v2(88.73,48.19) v2(88.95,89.83) v2(89.05,88.7) v2(89.29,92.94) v2(89.51,53.21) v2(89.63,51.22) v2(89.68,49.59) v2(89.68,48.19) v2(89.9,89.83) v2(90,88.7) v2(90.24,92.94) v2(90.33,87.68) v2(90.58,51.22) v2(90.63,49.59) v2(90.64,48.19) v2(90.79,90.85) v2(90.85,89.83) v2(90.96,88.7) v2(91.74,90.85) v2(91.81,89.83) v2(91.91,88.7) v2(92.05,13.55) v2(92.05,12.6) v2(92.05,11.65) v2(92.05,10.7) v2(92.51,60.59) v2(92.54,87.73) v2(93.09,13.68) v2(93.09,12.72) v2(93.09,11.77) v2(93.09,10.82) v2(93.34,83.24) v2(93.34,82.29) v2(93.34,81.34) v2(93.34,80.38) v2(93.49,88.96) v2(93.69,76.67) v2(93.85,87.79) v2(94.1,60.95) v2(94.1,60) v2(94.1,59.05) v2(94.25,74.68) v2(94.26,13.88) v2(94.26,12.93) v2(94.26,11.98) v2(94.26,11.02) v2(94.41,69.37) v2(94.44,88.96) v2(94.65,76.67) v2(94.8,87.79) v2(94.82,83.24) v2(94.82,82.29) v2(94.82,81.34) v2(94.82,80.38) v2(94.98,22.5) v2(94.98,21.55) v2(94.98,20.59) v2(94.98,19.64) v2(95.21,74.68) v2(95.39,88.96) v2(95.36,69.37) v2(95.6,76.67) v2(95.75,87.79) v2(95.84,14.03) v2(95.84,13.08) v2(95.84,12.13) v2(95.84,11.18) v2(96.16,74.68) v2(96.31,69.37) v2(96.35,88.96) v2(96.51,83.24) v2(96.51,82.29) v2(96.51,81.34) v2(96.51,80.38) v2(96.55,76.67) v2(96.7,87.79) v2(96.65,59.7) v2(96.65,58.74) v2(96.65,57.79) v2(96.65,56.84) v2(97.03,22.61) v2(97.03,21.66) v2(97.03,20.71) v2(97.03,19.75) v2(97.11,74.68) v2(97.26,69.37) v2(97.43,76.53) v2(97.43,55.9) v2(97.43,54.95) v2(97.43,54) v2(97.43,53.05) v2(97.43,51.93) v2(97.43,50.97) v2(97.43,50.02) v2(97.43,49.07) v2(97.63,13.34) v2(97.63,12.38) v2(97.63,11.43) v2(97.67,60.29) v2(97.67,59.34) v2(97.67,58.38) v2(97.67,57.43) v2(98.5,88.19) v2(98.5,76.24) v2(98.5,75.28) v2(98.5,53.61) v2(98.5,52.66) v2(98.5,51.7) v2(98.5,50.75) v2(98.55,57.84) v2(98.55,56.89) v2(98.55,55.94) v2(98.55,54.99) v2(98.59,19.03) v2(98.59,18.08) v2(98.59,17.12) v2(98.59,16.17) v2(98.85,23.21) v2(98.85,22.26) v2(98.85,21.31) v2(98.85,20.36) v2(99.01,48.92) v2(99.01,47.96) v2(99.01,47.01) v2(99.01,46.06) v2(99.01,44.58) v2(99.01,43.63) v2(99.01,42.68) v2(99.01,41.73) v2(98.96,40.25) v2(98.96,39.29) v2(98.96,38.34) v2(98.96,37.39) v2(98.97,31.57) v2(98.97,30.62) v2(98.97,29.66) v2(98.97,28.71) v2(98.96,27.55) v2(98.96,26.6) v2(98.96,25.64) v2(98.96,24.69) v2(99.11,66.36) v2(99.11,65.41) v2(99.11,64.46) v2(99.11,63.5) v2(99.11,61.97) v2(99.11,61.02) v2(99.11,60.07) v2(99.11,59.12) v2(99.06,35.91) v2(99.06,34.96) v2(99.06,34.01) v2(99.06,33.06) v2(99.16,75.39) v2(99.21,69.37) v2(99.21,68.59) v2(99.21,67.63) v2(99.16,13.37) v2(99.26,73.91) v2(99.26,72.96) v2(99.26,72) v2(99.26,71.05)
VIN_24V: length 12.5
  Top Layer w1.2: D1.2 28,20.2 C2.1 28.72,27.6
(no net):
  vias: v1(24.63,29.35) v1(24.66,31.27) v1(24.65,30.64) v1(24.66,30.03) v1(24.64,28.59) v1(25.3,31.27) v1(25.28,30.64) v1(25.3,30.03) v1(25.27,29.35) v1(25.28,28.59) v1(25.94,31.27) v1(25.92,30.64) v1(25.94,30.03) v1(25.91,29.35) v1(25.91,28.59) v1(26.57,31.27) v1(26.56,30.64) v1(26.57,30.03) v1(26.54,29.35) v1(26.55,28.59)
A_DIR_O: length 20.3
  Top Layer w0.4: U19.8 44.29,62.89 40.96,59.56 35.43,59.56 33.94,61.04 P32.3
A_EN_O: length 19.2
  Top Layer w0.4: 57.75,60.27 56.32,60.27 v2(56.31,60.27)
  Bottom Layer w0.4: P32.1 40.17,61.29 41.19,60.27 v2(56.31,60.27)
A_STEP_O: length 16.6
  Top Layer w0.4: U19.7 38.48,63.54 36.48,61.54 P32.2
B_DIR_O: length 59.4
  Top Layer w0.4: U20.8 49.96,56.37 v2(36.55,42.96)
  Bottom Layer w0.4: P33.3 3.11,31.58 5.23,33.7 27.29,33.7 v2(36.55,42.96)
B_EN_O: length 57.9
  Top Layer w0.4: v2(34.28,44.21) 47.74,57.67 U20.6
  Bottom Layer w0.4: P33.1 26.73,36.66 v2(34.28,44.21)
B_STEP_O: length 58.6
  Top Layer w0.4: U20.7 48.97,57.02 v2(35.04,43.09)
  Bottom Layer w0.4: P33.2 3.67,34.93 26.88,34.93 v2(35.04,43.09)
C_DIR_O: length 29.3
  Top Layer w0.4: H14.1 37.03,52.62 44.68,60.27 U20.2
C_EN_O: length 31.6
  Top Layer w0.4: P34.3 33.01,45.08 46.24,58.32 U20.5
C_STEP_O: length 28.5
  Top Layer w0.4: U20.1 44,60.92 40.35,57.26 28.01,57.26 H14.2
D_DIR_O: length 30.8
  Top Layer w0.4: P34.2 34.53,47.62 45.87,58.97 U20.4
D_STEP_O: length 30
  Top Layer w0.4: U20.3 45.4,59.62 35.95,50.16 P34.1
ESP_BOOT: length 28.2
  Top Layer w0.4: v2(66.41,29.54) 66.03,29.16 Q4.3 ; v2(79.72,44.78) 80.64,44.78 81.35,45.5 U3.25
  Bottom Layer w0.4: v2(66.41,29.54) 69.68,32.81 69.68,40 72.44,42.76 77.69,42.76 v2(79.72,44.78)
ESP_RST: length 69.9
  Top Layer w0.3: P21.5 97.98,30.34 97.98,25.91 95.74,23.67 78.04,23.67 76.32,25.39 R18.1 70.78,27.19 Q5.3
  Top Layer w0.4: v2(96.14,48.25) 95.32,49.08 U3.3
  Bottom Layer w0.4: P21.5 98.03,34.17 98.03,46.37 v2(96.14,48.25)
HOLD: length 47
  Top Layer w0.3: 89.87,19.12 89.87,20.25 90.48,20.87 v2(91.25,20.87) ; U3.7 90.24,61.19 93.34,58.1 v2(93.34,48.1)
  Bottom Layer w0.3: v2(93.34,48.1) 93.34,37.8 92.06,36.52 92.06,21.68 v2(91.25,20.87)
I2S_BCK: length 42.2
  Top Layer w0.4: 57.75,57.67 60.38,57.67 61.77,59.05 61.77,64.19 61.76,64.19 ; 61.76,64.19 74.24,64.19 77.12,67.07 83.75,67.07 86.43,64.39 U3.10 ; 61.76,64.19 57.75,64.19
I2S_DATA: length 35.7
  Top Layer w0.4: U3.8 88.97,64.81 85.13,68.65 76.05,68.65 74.02,66.63 70.45,66.63 70.44,66.61 59.33,66.61 58.87,66.14 57.75,66.14
I2S_MR#: length 22.1
  Top Layer w0.4: 57.75,57.02 60.2,57.02 60.66,56.56 ; 60.66,56.56 C28.2 62.48,58.54 v2(62.43,58.59) ; 60.66,56.56 55.94,51.85 R71.1 ; 57.75,63.54 58.91,63.54 v2(59.42,63.03)
  Bottom Layer w0.4: v2(59.42,63.03) 62.43,60.02 v2(62.43,58.59)
I2S_WS: length 43.5
  Top Layer w0.4: 57.75,64.84 59.61,64.84 60.1,65.34 70.44,65.34 70.45,65.36 74.03,65.36 76.51,67.84 84.51,67.84 87.73,64.62 87.73,62.95 U3.9 ; 57.75,58.32 59.56,58.32 60.49,59.25 v2(60.49,63.38)
  Bottom Layer w0.4: v2(60.49,63.38) v2(60.49,65.32)
IO4: length 12.1
  Top Layer w0.4: H13.2 72.62,43.82 81.81,43.82 82.62,44.62 U3.26
IO12: length 13.9
  Top Layer w0.4: H12.1 71.86,56.66 78.12,62.92 U3.14
IO14: length 16.3
  Top Layer w0.4: U3.13 82.62,64.22 82.12,64.73 78.6,64.73 73.07,59.2 H12.2
IO26: length 22.6
  Top Layer w0.4: H11.2 72.92,61.54 77.68,66.31 83.19,66.31 85.16,64.34 U3.11
IO27: length 21.7
  Top Layer w0.4: H11.1 68.41,60.65 68.41,60.66 68.69,60.94 73.59,60.94 78.24,65.59 82.47,65.59 83.89,64.18 U3.12
M_EN_O: length 87.1
  Top Layer w0.4: v2(56.21,66.55) 56.46,66.79 57.75,66.79
  Bottom Layer w0.4: 2.51,64 P29.1 P30.1 13.77,64 16.32,66.55 v2(56.21,66.55) ; 2.51,64 0.82,65.68 0.82,76.03 2.51,77.72 P28.1 ; 2.51,64 0.87,62.36 0.87,51.91 2.51,50.28 P31.1
PRE: length 59.6
  Top Layer w0.3: v2(94.87,48) 95.32,47.55 U3.36
  Top Layer w0.4: R20.1 63.25,75.67 v2(64.32,74.6)
  Bottom Layer w0.3: v2(94.31,67.58) 94.87,67.02 94.87,66.84 94.96,66.75 94.96,66.17 94.87,66.08 v2(94.87,48)
  Bottom Layer w0.4: v2(64.32,74.6) 74.67,74.6 78.9,70.37 91.52,70.37 v2(94.31,67.58)
PROBE: length 31
  Top Layer w0.4: U3.23 78.25,49.98 76.46,51.77 76.46,59.27 v2(77.48,60.29) ; R12.1 89.79,69.18 v2(89.31,69.66)
  Bottom Layer w0.4: v2(77.48,60.29) 86.84,69.66 v2(89.31,69.66)
PWM: length 32.1
  Top Layer w0.4: U6.2 57.47,47.13 R58.1 59.86,47.61 60.75,48.49 v2(60.75,51.77) ; v2(77.58,56.36) 77.58,57.74 78.71,58.87 U3.16
  Bottom Layer w0.4: v2(60.75,51.77) 72.94,51.77 77.53,56.36 v2(77.58,56.36)
PWM_5V: length 54.8
  Top Layer w0.4: v2(34.69,37.93) 22.85,37.93 15.36,30.44 15.36,24.27 10.32,19.23 P19.2 ; v2(42.03,40.18) 42.05,40.16 R33.1 45.04,41.98 Q1.3
  Bottom Layer w0.4: v2(34.69,37.93) 39.79,37.93 v2(42.03,40.18)
PWM_OUT: length 4.3
  Top Layer w0.4: R59.2 46.84,46.5 46.79,46.45 R37.2
RUN: length 8.9
  Top Layer w0.4: U3.24 78.95,48.71 77.89,47.65 73.32,47.65 H13.1
RXD: length 54.3
  Top Layer w0.4: v2(69.47,31.28) 58.98,31.28 56.87,29.18 56.87,26.26 ; P21.8 90.26,38.06 v2(90.24,38.06) ; U3.34 92.78,44.52 85.95,37.7 v2(83.7,37.7)
  Bottom Layer w0.4: v2(90.24,38.06) 90.24,39.03 v2(88.76,40.51) ; v2(69.47,31.28) 75.84,37.66 83.66,37.66 v2(83.7,37.7)
RXD2: length 33.3
  Top Layer w0.4: U3.27 83.89,44.52 81.5,42.13 76.46,42.13 P15.2
  Bottom Layer w0.4: P15.2 76.09,39.34 84.58,39.34 85.54,38.37 85.54,31.25 87.17,29.63 P23.2
SD_CD: length 44.7
  Top Layer w0.4: U3.33 91.46,45.87 91.46,44.33 89.41,42.29 87.01,42.29 75.31,30.58 v2(75.31,30.43) ; U8.9 65.16,17.12 65.83,17.79 R68.1
  Bottom Layer w0.4: v2(65.75,17.65) 65.75,20.87 v2(75.31,30.43)
SD_CS: length 38.7
  Top Layer w0.4: U8.2 72.86,16.86 v2(73.14,17.14) 73.14,18.48 R63.1 ; U3.29 86.43,44.62 77.46,35.66 v2(77.27,35.66)
  Bottom Layer w0.4: v2(73.14,17.14) 77.27,21.27 v2(77.27,35.66)
SD_MISO: length 46.6
  Top Layer w0.4: R66.1 67.82,17.79 67.36,17.33 U8.7 ; U3.31 88.97,43.99 87.83,42.85 86.4,42.85 v2(75.08,31.52)
  Bottom Layer w0.4: v2(67.38,16.48) 65.75,16.48 64.78,17.45 64.78,21.22 v2(75.08,31.52)
SD_MOSI: length 50.2
  Top Layer w0.4: U3.37 96.59,44.26 v2(91.2,38.87) ; R64.1 71.34,17.69 71.76,17.27 U8.3
  Bottom Layer w0.4: v2(71.82,16.22) 82.27,16.22 91.2,25.15 v2(91.2,38.87)
SD_SCLK: length 39.4
  Top Layer w0.4: v2(76.46,34.13) 76.86,34.13 86.35,43.61 86.92,43.61 87.7,44.4 U3.30 ; v2(69.62,16.28) 69.56,16.22 U8.5
  Bottom Layer w0.4: v2(69.62,16.28) 76.41,23.06 76.41,34.07 v2(76.46,34.13)
START: length 23
  Top Layer w0.4: v2(72.78,72.89) 73.77,73.87 R19.1
  Bottom Layer w0.4: v2(72.33,53.2) 72.78,53.66 v2(72.78,72.89)
TXD: length 54.5
  Top Layer w0.4: v2(82.88,36.68) 86.2,36.68 87.63,38.11 ; v2(70.8,30.81) 70.49,30.5 60.09,30.5 58.76,29.18 R61.2 ; 87.63,38.11 94.05,44.52 U3.35 ; 87.63,38.11 87.67,38.11 P21.6
  Bottom Layer w0.4: v2(82.88,36.68) 82.82,36.74 76.67,36.74 70.8,30.86 v2(70.8,30.81)
TXD2: length 30.4
  Top Layer w0.4: P15.3 81.4,40.55 85.16,44.31 U3.28
  Bottom Layer w0.4: P23.3 87.67,32.17 89.12,33.61 89.12,38.17 86.73,40.55 P15.3
USB_DM: length 8.2
  Top Layer w0.4: 44.2,12.71 44.2,15.43 44.91,16.14 U9.3
USB_DP: length 13
  Top Layer w0.4: U9.1 45.33,18.04 42.8,15.51 42.8,12.12 44.2,10.71
VUSB: length 22.6
  Top Layer w0.4: P22.1 48.87,12.71 50.8,14.64 50.8,16.38 51.52,17.09 U9.5
  Top Layer w0.6: H10.2 40.81,16.53 v2(40.81,14.69)
  Bottom Layer w0.6: P22.1 44.72,14.69 v2(40.81,14.69)
X_DIR_O: length 51.7
  Top Layer w0.4: U19.2 33.11,66.79 28.21,71.7 9.08,71.7 8.15,72.64 P28.3
X_LIMT: length 27.2
  Top Layer w0.3: U3.6 91.51,64.46 86.4,69.57 86.4,75.28 84.41,77.27 81.61,77.27 79.06,79.82 79.06,81.78 R2.2
X_LIMT_I: length 20.9
  Top Layer w0.4: P1.1 67.02,97.15 70.13,94.04 70.13,90.06 75.3,84.89 R1.1 R2.1 76.35,81.78 76.36,81.77 C1.2
X_STEP_O: length 52.5
  Top Layer w0.4: U19.1 34.81,67.44 29.13,73.13 10.46,73.13 8.41,75.18 P28.2
Y_DIR_O: length 52
  Top Layer w0.4: P30.3 14.31,58.92 20.88,65.49 U19.4
  Bottom Layer w0.4: P29.3 P30.3
Y_LIMT: length 24.4
  Top Layer w0.3: R5.2 83.44,81.63 83.44,79.41 87.01,75.84 87.01,70.03 92.78,64.26 U3.5
Y_LIMT_I: length 19.3
  Top Layer w0.4: P2.1 73.75,97.15 77.88,93.02 77.88,88.8 80.59,86.1 80.59,81.83 80.64,81.77 C4.2
Y_STEP_O: length 51.2
  Top Layer w0.4: U19.3 18.46,66.14 13.77,61.46 P30.2
  Bottom Layer w0.4: P29.2 P30.2
Z_DIR_O: length 57.1
  Top Layer w0.4: P31.3 11.3,45.2 30.29,64.19 U19.6
Z_LIMT: length 23.1
  Top Layer w0.3: R9.2 86.41,82.87 87.88,81.4 87.88,70.12 94.05,63.95 U3.4
Z_LIMT_I: length 19.1
  Top Layer w0.4: P3.1 82.01,97.15 84.83,94.33 C11.2
Z_STEP_O: length 56.3
  Top Layer w0.4: U19.5 29.57,64.84 12.46,47.74 P31.2
$9N72390: length 10.5
  Top Layer w0.8: D2.2 33.97,23.17 L1.2 31,29.26 U1.2
$9N72392: length 2.8
  Top Layer w0.6: U1.4 28.52,32.07 R7.1
$9N72730: length 2.1
  Top Layer w0.4: R3.1 17.8,12.73 D3.1
$9N85928: length 7.8
  Top Layer w0.3: 55.41,15.43 54.61,15.43 53.97,16.07 53.97,20.57 53.39,21.14 C23.1
$9N85949: length 6
  Top Layer w0.3: 55.41,14.16 54.73,14.16 53.3,15.59 53.3,17.45 52.71,18.04 U9.6
$9N85958: length 5
  Top Layer w0.3: 55.41,12.89 54.73,12.89 52.15,15.47 U9.4
$9N85962: length 12.6
  Top Layer w0.3: Y1.2 60.3,6.48 58.35,8.43 58.35,10.67 57.4,11.62 55.41,11.62
  Top Layer w0.4: C24.1 61.05,3.41 Y1.2
$9N85965: length 7.3
  Top Layer w0.3: Y1.1 55.41,6.52 55.41,10.35
  Top Layer w0.4: Y1.1 55.45,3.36 C25.1
$9N86544: length 8.3
  Top Layer w0.3: U7.2 56.68,17.97 57.54,18.83 57.54,21.83 56.87,22.5 R60.1
$9N86546: length 9.7
  Top Layer w0.3: U7.3 56.64,16.7 58.35,18.42 58.35,23.4 58.76,23.8 R61.1
$9N86982: length 16.7
  Top Layer w0.3: Q4.2 66.44,27.16 66.92,26.68 66.92,24.13 66.32,23.53 R69.1 65.59,22.8 64.32,21.53 64.32,16.73 63.02,15.43 U7.13
$9N86987: length 15.1
  Top Layer w0.3: Q5.2 67.63,25.66 v2(67.63,25.41) ; R62.1 v2(63.6,22.29) 63.6,17.65 62.65,16.7 U7.14
  Bottom Layer w0.3: v2(63.6,22.29) 64.52,22.29 v2(67.63,25.41)
$9N88961: length 2.9
  Top Layer w0.4: U6.4 50.19,48.08 50.18,48.1
$9N89334: length 2
  Top Layer w0.3: 63.6,25.13 63.62,25.15 Q4.1
$9N89338: length 4.8
  Top Layer w0.3: Q5.1 v2(67.02,28.14) ; 65.59,25.13 65.59,25.41 v2(66.26,26.07)
  Bottom Layer w0.3: v2(66.26,26.07) 67.02,26.83 v2(67.02,28.14)
$9N98710: length 32.1
  Top Layer w0.4: K1.3 82.78,5.27 84.06,3.98 P7.1 ; K1.3 82.78,20 80.08,22.7 73.67,22.7 R18.2 ; K1.3 79.62,18.23 79.31,18.54
$9N100309: length 8.9
  Top Layer w0.4: 77.46,70.27 77.46,72.15 C15.2 ; C15.2 78.16,72.23 78.52,71.87 P8.1 ; C15.2 77.33,72.27 R19.2
$9N100484: length 10.8
  Top Layer w0.4: C12.2 89.09,73.4 R11.2 ; P4.1 90.91,70.85 R12.2 90.84,71.52 89.05,73.31
$9N100628: length 9.2
  Top Layer w0.4: R20.2 65.01,80.32 C16.2 65.19,80.29 R17.2 66.14,78.33 66.37,78.09 P6.1
$9N100772: length 9.6
  Top Layer w0.4: P5.1 93.5,15.77 C13.2 91.67,17.52 89.87,17.52 89.87,15.19 R13.2
$9N100840: length 2.3
  Top Layer w0.4: R10.1 17.81,17.11 D7.1
$9N100955: length 2.2
  Top Layer w0.4: R6.1 15.79,15.01 D5.1
$9N127007: length 5.6
  Top Layer w0.4: 57.75,62.89 58.44,62.89 59.32,62.02 59.32,60.17 58.76,59.62 57.75,59.62
$9N127825: length 6.8
  Top Layer w0.4: R34.1 47.28,40.16 45.94,41.51 45.94,44.03 47.25,44.03 R36.2

## Copper pours and planes (outline as drawn; the poured copper is in the pictures)
GND on Top Layer: -1.95,101.84 102.3,101.84 102.3,-2.41 -1.95,-2.41
GND on Bottom Layer: -2.66,102.35 101.58,102.35 101.58,-1.9 -2.66,-1.9

Small or netless copper shapes (teardrops, artwork), in the pictures only: 355 on Top Layer, 91 on Bottom Layer

## Text on the board
Top Silkscreen Layer: CLK_Y1 | DIR_Y1 | 5V | CLK_X | EN | DIR_X | CLK_Z | DIR_Z | 24V+ | CLK_Y2 | DIR_Y2 | GND | X_LIMIT | Y_LIMIT | Z_LIMIT | Reset | LIMIT | PWM2 | Pre | RX | TX | Start | Hold | Probe | RX2 | TX2 | 20250815
